# EAGLE design Sony PSP USB-C (EAGLE 6.2)
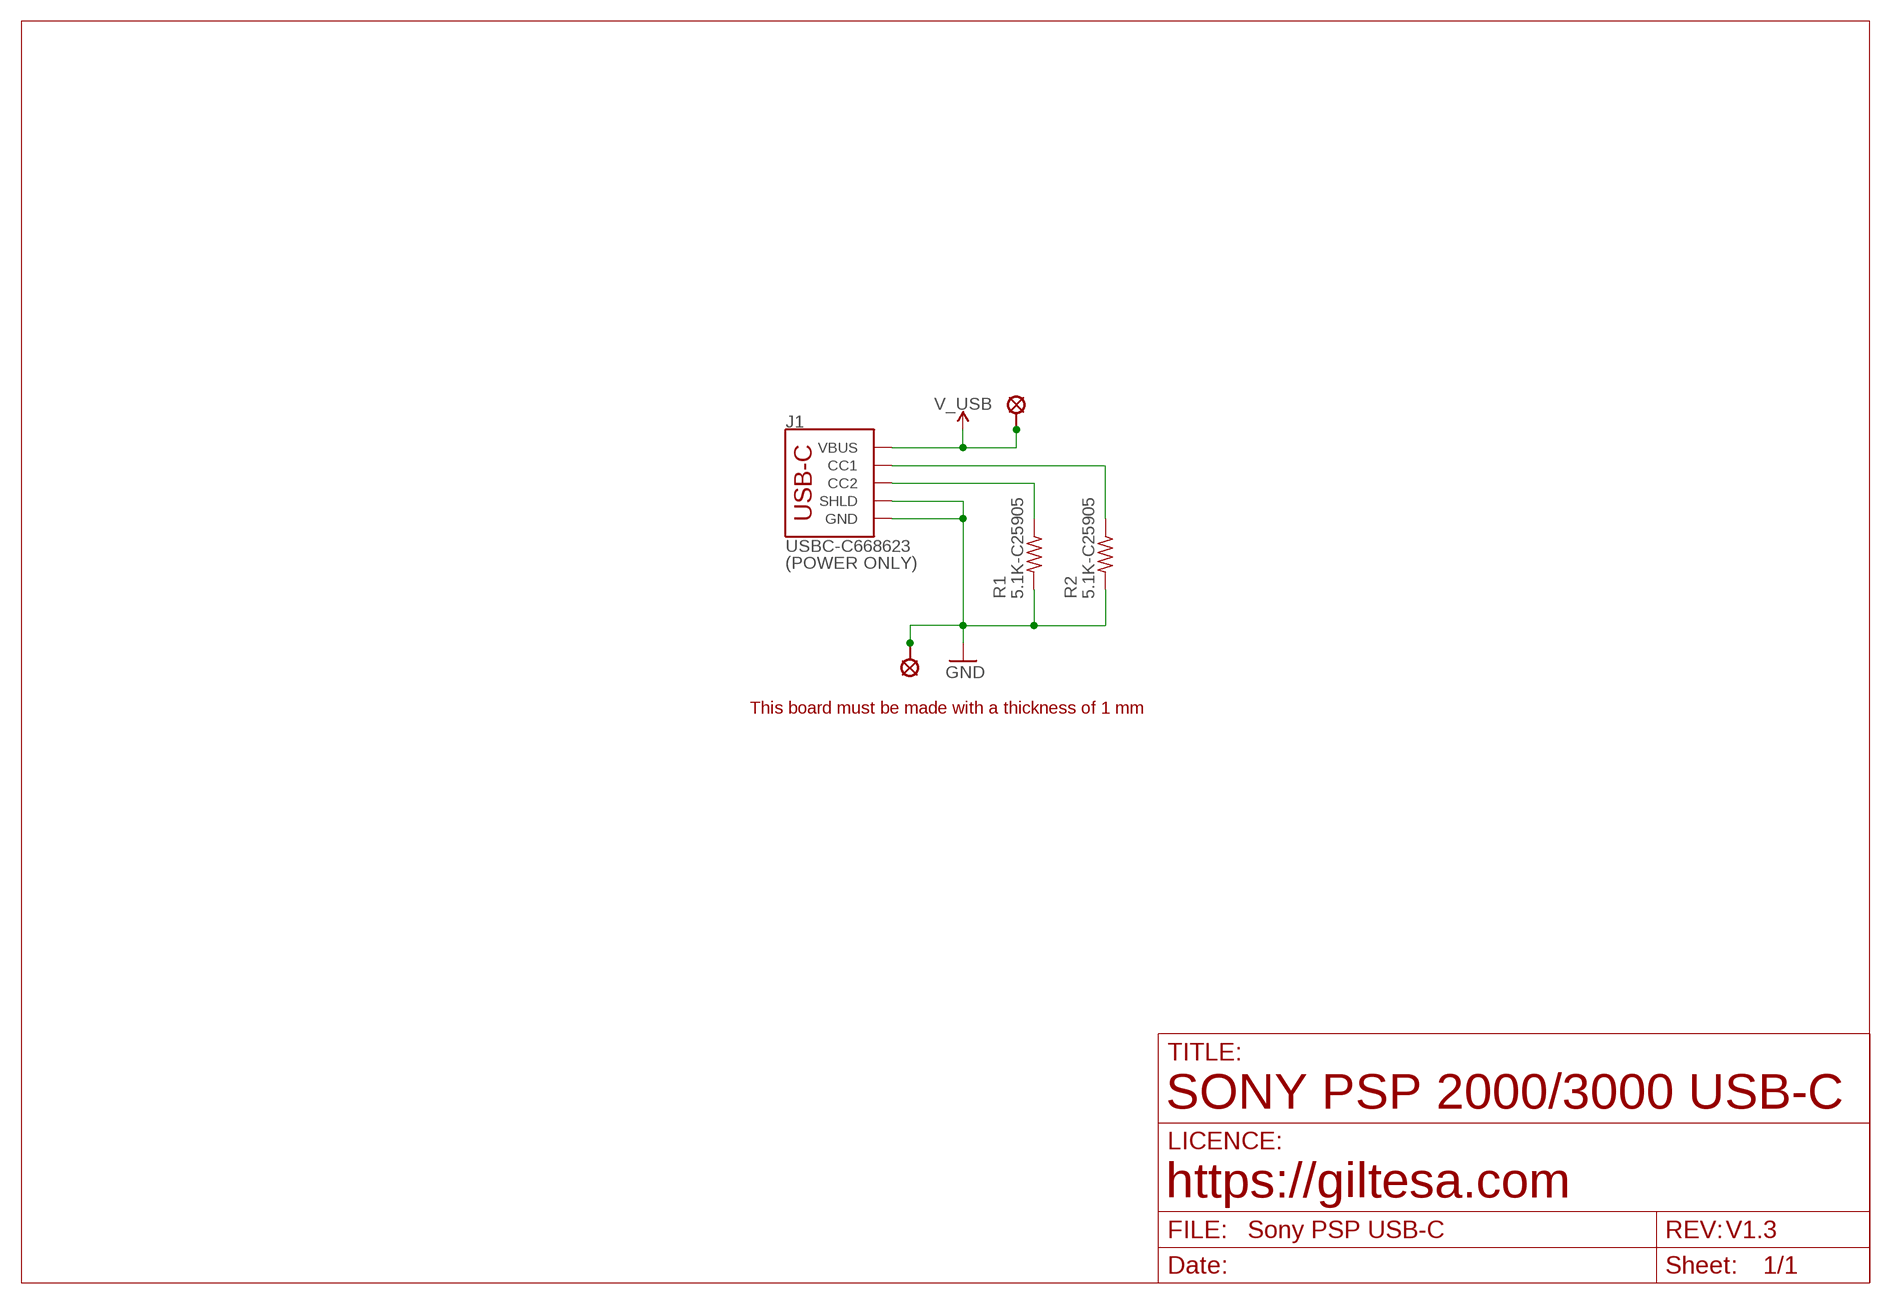
[diagram p0: schematic, sheet 1]

## Parts
J1  USBC-C668623  USB-C_6P_POWER  [USB-C_6P]
R1  5.1K-C25905  R0402  [R0402]
R2  5.1K-C25905  R0402  [R0402]
U$1  SOLDER_PAD_N3DS  [N3DS_TPAD]
U$2  SOLDER_PAD_N3DS  [N3DS_TPAD]
U$3  SOLDER_PAD_N3DS  [N3DS_TPAD]
U$4  SOLDER_PAD_N3DS  [N3DS_TPAD]

## Nets
GND: J1.A12-GND(GND) J1.B12-GND(GND) J1.SHLD1(SHLD) J1.SHLD2(SHLD) J1.SHLD3(SHLD) J1.SHLD4(SHLD) R1.2 R2.2 U$1.1 U$4.1
N$4: J1.B5(CC2) R1.1
N$13: J1.A5(CC1) R2.1
V_USB: J1.A9-VBUS(VBUS) J1.B9-VBUS(VBUS) U$2.1 U$3.1

## Notes on the sheet
- (POWER ONLY)
- This board must be made with a thickness of 1 mm
- SONY PSP 2000/3000 USB-C
- https://giltesa.com
- V1.3

## Library data of the parts
J1 = ,giltesa:USB-C_6P
R1 R2 = ,giltesa:R0402
U$1-U$4 = ,giltesa:SOLDER_PAD

## Net classes
1 power: width 0.61 mm, drill 0.406 mm, clearance 0.203 mm
2 gnd: width 0.305 mm, drill 0.406 mm, clearance 0.203 mm
3 power usb: width 0.508 mm, drill 0.406 mm, clearance 0.203 mm

## Board
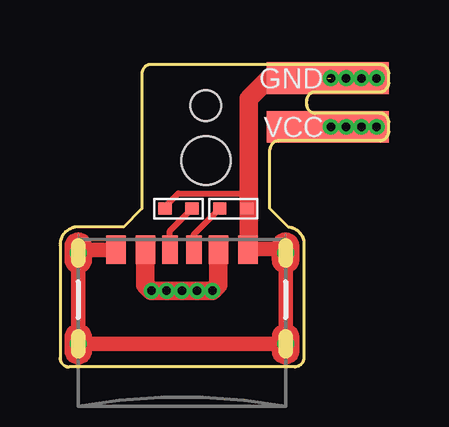
[diagram p1: board, top side]
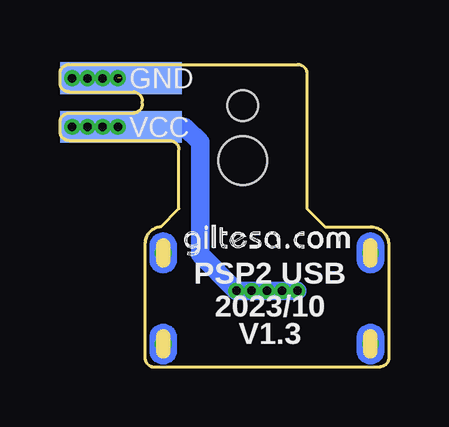
[diagram p2: board, bottom side, seen from below]

Size 13.7 x 12.62 mm. Coordinates in mm from the lower left corner, seen from the top.
Outline: 2.65,5.84 0.76,5.84 arc90 0,5.08 0,0.38 arc90 0.38,0 9.78,0 arc90 10.16,0.38 10.16,5.08 arc90 9.51,5.84 8.75,6.6 8.75,9.06 arc-90 9.13,9.44 13.32,9.44 arc90 13.7,9.82 13.7,10.2 arc90 13.32,10.58 10.65,10.58 arc-90 10.27,10.96 10.27,11.09 arc-90 10.65,11.47 13.32,11.47 arc90 13.7,11.85 13.7,12.23 arc90 13.32,12.62 3.79,12.62 arc90 3.41,12.23 3.41,6.6 2.65,5.84
Copper layers (1*16): Top 0.035mm / dielectric 1.6mm / Bottom 0.035mm
Design rules: minimum track width 6mil, minimum drill 12mil, track to track 6mil, track to pad 6mil, pad to pad 6mil, via to via 8mil, smd to smd 0mil, copper to edge 20mil, drill to drill 10mil, minimum pad ring 6mil, minimum via ring 6mil, stop-mask expansion 0mil, vias tented up to drill 100mil, thermal gap 10mil
Holes 2.03 mm at 6.08,8.61
Holes 1.27 mm at 6.08,10.9

### Footprints (pad centres in the part's own frame; a part is rotated, then mirrored left to right if it is on the bottom)
USB-C_6P = smd 0.635 x 1.2: A5 -0.5,2.034; B5 0.5,2.034 | smd 0.8 x 1.2: A9-VBUS 1.52,2.034; A12-GND 2.75,2.034; B9-VBUS -1.52,2.034; B12-GND -2.75,2.034 | drill 0.4 pad 0.6: SHLD1 -4.318,1.9; SHLD2 4.32,1.9; SHLD3 -4.318,-1.9; SHLD4 4.32,-1.9
R0402 = smd 0.559 x 0.5: 1 -0.567,0; 2 0.567,0
N3DS_TPAD = smd 1.321 x 5.08: 1 0,0

### Placement (x,y rotation side)
J1  5.08,2.85 0 top
R1  7.22,6.6 0 top
R2  4.94,6.6 180 top
U$1  11.16,12.04 270 top
U$2  11.16,10.01 90 bottom
U$3  11.16,10.01 270 top
U$4  11.16,12.04 90 bottom
U$11  [GILTESA.COM_MASK_7MM]  8.56,4.57 0 bottom

### Tracks (layer width: path | path; a pad name or v marks a point on that pad's centre or on a via)
GND  (via drill 0.36)  (1 unrouted)
  Top 0.127: U$1.1 v12.56,12.04 v13.19,12.04 | R1.2 7.79,6.93 7.86,7
  Top 0.254: R1.2 7.86,6.6 | R2.2 4.37,6.67 4.94,7.24 7.86,7.24
  Top 0.61: 7.86,4.92 9.4,4.92 J1.SHLD2 J1.SHLD4 J1.SHLD3 J1.SHLD1 0.76,4.89 J1.B12-GND
  Top 0.762: J1.A12-GND 7.86,4.92 7.86,7 7.86,7.24 7.86,11.19 8.71,12.04 U$1.1
  Bottom 0.127: v11.92,12.04 v13.19,12.04
  Bottom 0.61: v11.92,12.04 U$1.1
  other vias: 11.29,12.04
N$4
  Top 0.254: 5.53,4.63 J1.B5 5.58,5.53 R1.1
N$13
  Top 0.254: 4.63,4.63 J1.A5 4.58,5.68 R2.1
V_USB  (via drill 0.36)
  Top 0.127: U$3.1 v13.19,10.01 v12.56,10.01
  Top 0.762: J1.B9-VBUS 3.56,3.42 v3.81,3.17 v6.35,3.17 6.6,3.42 J1.A9-VBUS
  Bottom 0.127: v11.29,10.01 v11.92,10.01 | v12.56,10.01 v13.19,10.01
  Bottom 0.406: v11.29,10.01 U$3.1
  Bottom 0.61: U$3.1 8.81,10.01 | v12.56,10.01 v11.92,10.01
  Bottom 0.762: v3.81,3.17 v4.45,3.17 v5.08,3.17 v5.71,3.17 v6.35,3.17 7.86,4.68 7.86,9.37 8.5,10.01 8.81,10.01

### Text on the board
tPlace: GND | VCC
bPlace: GND | VCC | PSP2 USB | 2023/10 | V1.3